# EAGLE design OpAmpLab (EAGLE 7.6.0)
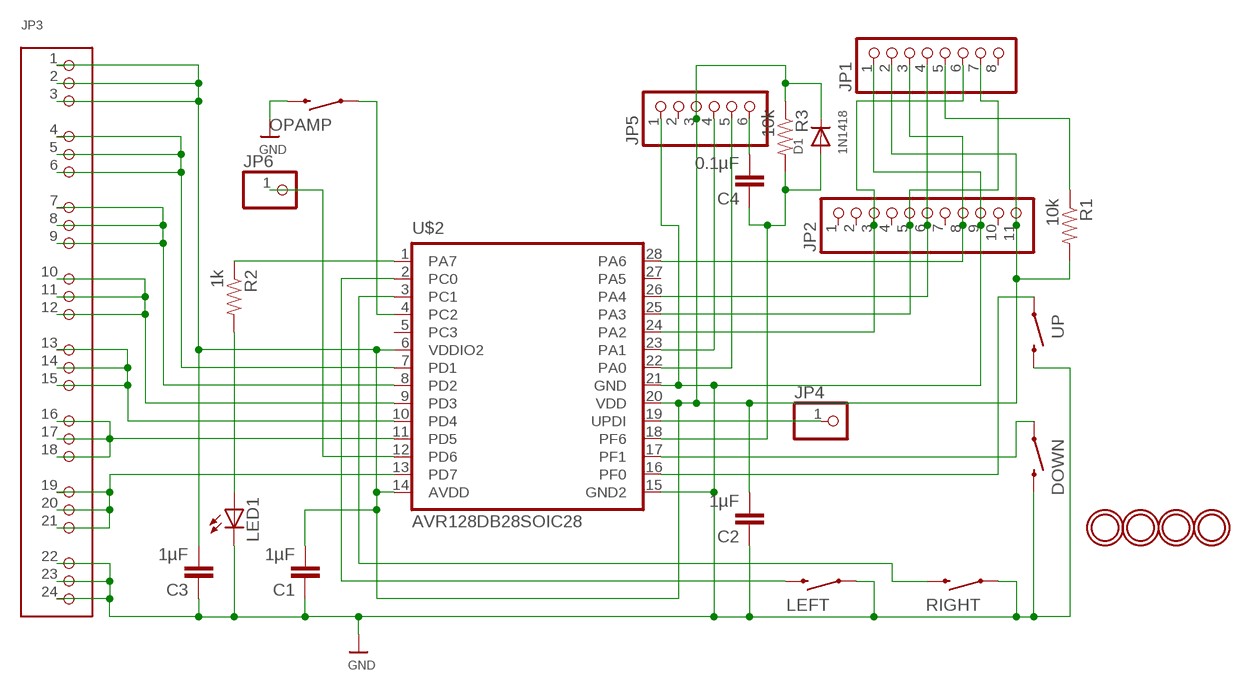
[diagram p0: schematic, sheet 1]

## Parts
C1  1µF  CAP0805  [0805]
C2  1µF  CAP0805  [0805]
C3  1µF  CAP0805  [0805]
C4  0.1µF  CAP0805  [0805]
D1  1N1418  DIODESOD-323F  [SOD-323F]
DOWN  SWITCH-MOMENTARY-2PTH  [TACTILE-PTH]
JP1  HEADER-1X8ROUND  [1X08_ROUND]
JP2  HEADER-1X11  [1X11_ROUND]
JP3  HEADER-3X08  [3X08]
JP4  HEADER-1X1ROUND  [1X01_ROUND]
JP5  HEADER-1X6ROUND  [1X06_ROUND]
JP6  HEADER-1X1ROUND  [1X01_ROUND]
LED1  LEDCHIPLED_0805  [CHIPLED_0805]
LEFT  SWITCH-MOMENTARY-2PTH  [TACTILE-PTH]
OPAMP  SWITCH-MOMENTARY-2PTH  [TACTILE-PTH]
R1  10k  0.3OHM-1/8W-1%(0805)  [0805]
R2  1k  0.3OHM-1/8W-1%(0805)  [0805]
R3  10k  0.3OHM-1/8W-1%(0805)  [0805]
RIGHT  SWITCH-MOMENTARY-2PTH  [TACTILE-PTH]
U$1  MOUNTINGHOLE2.5  [MOUNTINGHOLE_2.5_PLATED]
U$2  AVR128DB28SOIC28  [SO-28W]
U$4  MOUNTINGHOLE2.5  [MOUNTINGHOLE_2.5_PLATED]
U$5  MOUNTINGHOLE2.5  [MOUNTINGHOLE_2.5_PLATED]
U$9  MOUNTINGHOLE2.5  [MOUNTINGHOLE_2.5_PLATED]
UP  SWITCH-MOMENTARY-2PTH  [TACTILE-PTH]

## Nets
GND: C1.1 C2.1 C3.1 DOWN.3 JP1.1 JP2.9 JP3.22 JP3.23 JP3.24 JP5.1 LED1.C LEFT.1 OPAMP.3 RIGHT.1 U$2.15(GND2) U$2.21(GND) UP.3
N$1: JP4.1 U$2.19(UPDI)
N$2: JP1.7 JP2.5 U$2.25(PA3)
N$3: JP5.4 U$2.23(PA1)
N$4: JP1.5 R1.1
N$5: JP1.3 JP2.8 U$2.28(PA6)
N$6: JP6.1 U$2.12(PD6)
N$7: OPAMP.1 U$2.4(PC2)
N$8: U$2.16(PF0) UP.1
N$9: R2.1 U$2.1(PA7)
N$10: DOWN.1 U$2.17(PF1)
N$11: JP3.4 JP3.5 JP3.6 U$2.7(PD1)
N$12: LEFT.3 U$2.2(PC0)
N$13: RIGHT.3 U$2.3(PC1)
N$14: JP3.7 JP3.8 JP3.9 U$2.8(PD2)
N$15: JP1.4 JP2.6 U$2.26(PA4)
N$16: JP1.6 JP2.3 U$2.24(PA2)
N$17: JP5.5 U$2.22(PA0)
N$18: JP3.10 JP3.11 JP3.12 U$2.9(PD3)
N$19: JP3.19 JP3.20 JP3.21 U$2.13(PD7)
N$20: JP3.13 JP3.14 JP3.15 U$2.10(PD4)
N$21: LED1.A R2.2
N$22: JP3.16 JP3.17 JP3.18 U$2.11(PD5)
N$23: C4.2 JP5.6
N$24: C4.1 D1.A R3.2 U$2.18(PF6)
VDD: C1.2 C2.2 C3.2 D1.C JP1.2 JP2.11 JP3.1 JP3.2 JP3.3 JP5.3 R1.2 R3.1 U$2.6(VDDIO2) U$2.14(AVDD) U$2.20(VDD)
Unconnected: JP1.8 JP2.1 JP2.2 JP2.4 JP2.7 JP2.10 JP5.2 U$2.5(PC3) U$2.27(PA5)

## Library data of the parts
C1-C4 = SparkFun-Capacitors:CAP: Capacitor Standard 0603 ceramic capacitor, and 0.1" leaded capacitor.
D1 = adafruit:DIODE: Diode SMADIODE - SMA Surface Mount Package 20V 1A Schottky Diode Digikey: 641-1014-6-ND DO-1N4148 - Through Hole Small Current Diode SOD-123 20V 1 A (.5mV Vf) Schottky Diode - Digikey: MBRX120TPMSCT-ND SOD-323 10V 570mA (.38mV Vf, 3ns) Schottky Diode - Digikey: ZLLS410CT-ND SOD-523 30V 30mA Schottky Diode (RB751S-40TE61) - Digikey: RB751S-40TE61CT-ND SOT23-R/W - SOT23 Package (R = Solder Paste/Reflow Ovens, W = Hand-Soldering) BAT54Film 40V 300mA - Digikey: 497-7162-1-ND
DOWN LEFT OPAMP RIGHT UP = SparkFun-Electromechanical:SWITCH-MOMENTARY-2: Various NO switches- pushbuttons, reed, etc; PROD_ID: SWCH-08441
JP1 = technoblogy:HEADER-1X8: PIN HEADER
JP2 = technoblogy:HEADER-1X11
JP3 = microbuilder:HEADER-3X08: 3x8 0.1" Headers Male - 4UCON: 01058
JP4 JP6 = microbuilder:HEADER-1X1: PIN HEADER
JP5 = microbuilder:HEADER-1X6: PIN HEADER
LED1 = adafruit:LED: LED OSRAM: - CHIPLED LG R971, LG N971, LY N971, LG Q971, LY Q971, LO R971, LY R971 LH N974, LH R974 LS Q976, LO Q976, LY Q976 LO Q996 - Hyper CHIPLED LW Q18S LB Q993, LB Q99A, LB R99A - SideLED LS A670, LO A670, LY A670, LG A670, LP A670 LB A673, LV A673, LT A673, LW A673 LH A674 LY A675 LS A676, LA A676, LO A676, LY A676, LW A676 LS A679, LY A679, LG A679 - Hyper Micro SIDELED® LS Y876, LA Y876, LO Y876, LY Y876 LT Y87S - SmartLED LW L88C, LW L88S LB L89C, LB L89S, LG L890 LS L89K, LO L89K, LY L89K LS L896, LA L896, LO L896, LY L896 - TOPLED LS T670, LO T670, LY T670, LG T670, LP T670 LSG T670, LSP T670, LSY T670, LOP T670, LYG T670 LG T671, LOG T671, LSG T671 LB T673, LV T673, LT T673, LW T673 LH T674 LS T676, LA T676, LO T676, LY T676, LB T676, LH T676, LSB T676, LW T676 LB T67C, LV T67C, LT T67C, LS T67K, LO T67K, LY T67K, LW E67C LS E67B, LA E67B, LO E67B, LY E67B, LB E67C, LV E67C, LT E67C LW T67C LS T679, LY T679, LG T679 LS T770, LO T770, LY T770, LG T770, LP T770 LB T773, LV T773, LT T773, LW T773 LH T774 LS E675, LA E675, LY E675, LS T675 LS T776, LA T776, LO T776, LY T776, LB T776 LHGB T686 LT T68C, LB T68C - Hyper Mini TOPLED® LB M676 - Mini TOPLED Santana® LG M470 LS M47K, LO M47K, LY M47K Source: http://www.osram.convergy.de/
R1-R3 = SparkFun-Resistors:0.3OHM-1/8W-1%(0805): RES-11622; PROD_ID: RES-11622; VALUE: 0.3
U$1 U$4 U$5 U$9 = microbuilder:MOUNTINGHOLE: Mounting Hole For #2 screws (0.086"/2.18mm width, 0.094"/2.4mm hole) use 2.5mm; BOM: EXCLUDE
U$2 = technoblogy:AVR128DB28

## Board
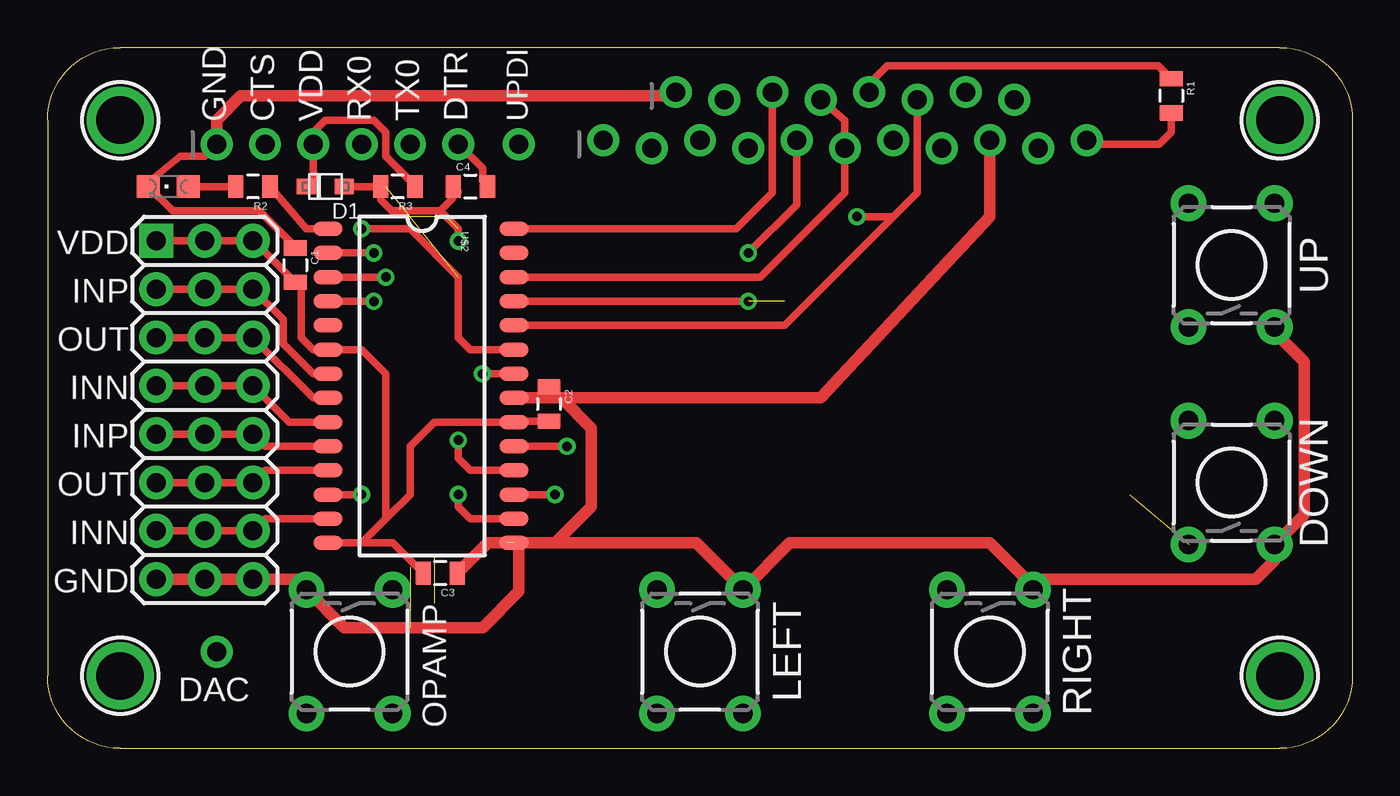
[diagram p1: board, top side]
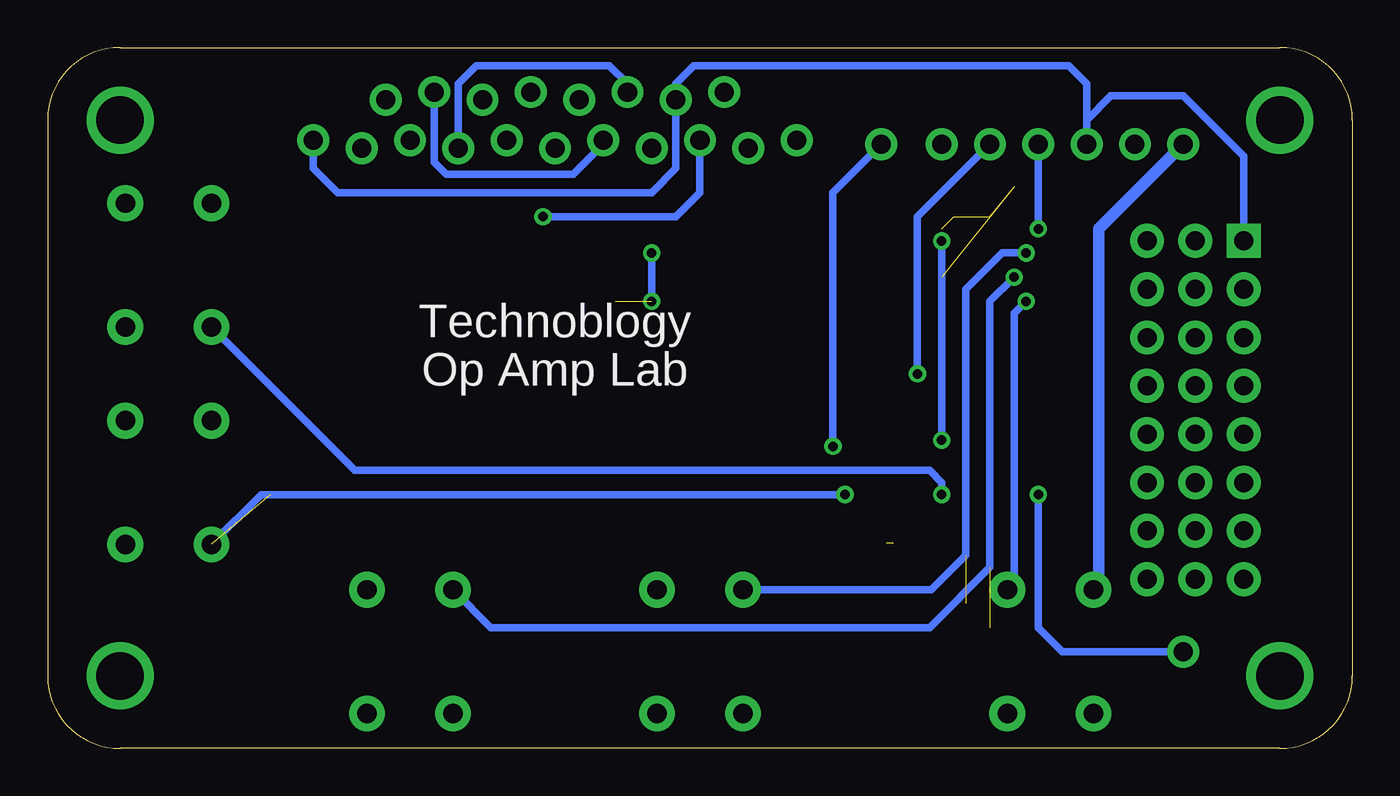
[diagram p2: board, bottom side, seen from below]

Size 68.58 x 36.83 mm. Coordinates in mm from the lower left corner, seen from the top.
Outline: 0,33.02 arc-90 3.81,36.83 64.77,36.83 arc-90 68.58,33.02 68.58,3.81 arc-90 64.77,0 3.81,0 arc-90 0,3.81 0,33.02
Copper layers (1*16): Top 0.035mm / dielectric 1.5mm / Bottom 0.035mm
Design rules "default *": minimum track width 10mil, minimum drill 24mil, track to track 8mil, track to pad 8mil, pad to pad 8mil, via to via 8mil, smd to smd 8mil, copper to edge 40mil, drill to drill 8mil, minimum pad ring 10mil, minimum via ring 8mil, stop-mask expansion 4mil, vias tented up to drill 20mil, thermal gap 10mil

### Footprints (pad centres in the part's own frame; a part is rotated, then mirrored left to right if it is on the bottom)
0805 = smd 0.8 x 1.2: 1 -0.9,0; 2 0.9,0
SOD-323F = smd 1 x 0.8: A -1,0; C 1,0
TACTILE-PTH = drill 1.016 pad 1.88: 1 -3.251,2.261; 2 3.251,2.261; 3 -3.251,-2.261; 4 3.251,-2.261
1X08_ROUND = drill 1 pad 1.676: 1 -8.89,0.203; 2 -6.35,-0.203; 3 -3.81,0.203; 4 -1.27,-0.203; 5 1.27,0.203; 6 3.81,-0.203; 7 6.35,0.203; 8 8.89,-0.203
1X11_ROUND = drill 1 pad 1.676: 1 -12.7,0.203; 2 -10.16,-0.203; 3 -7.62,0.203; 4 -5.08,-0.203; 5 -2.54,0.203; 6 0,-0.203; 7 2.54,0.203; 8 5.08,-0.203; 9 7.62,0.203; 10 10.16,-0.203; 11 12.7,0.203
3X08 = drill 1 pad 1.778 square: 1 -8.89,-2.54 | drill 1 pad 1.778: 2 -8.89,0; 3 -8.89,2.54; 4 -6.35,-2.54; 5 -6.35,0; 6 -6.35,2.54; 7 -3.81,-2.54; 8 -3.81,0; 9 -3.81,2.54; 10 -1.27,-2.54; 11 -1.27,0; 12 -1.27,2.54; 13 1.27,-2.54; 14 1.27,0; 15 1.27,2.54; 16 3.81,-2.54; 17 3.81,0; 18 3.81,2.54; 19 6.35,-2.54; 20 6.35,0; 21 6.35,2.54; 22 8.89,-2.54; 23 8.89,0; 24 8.89,2.54
1X01_ROUND = drill 1 pad 1.676: 1 0,0
1X06_ROUND = drill 1 pad 1.676: 1 -6.35,0; 2 -3.81,0; 3 -1.27,0; 4 1.27,0; 5 3.81,0; 6 6.35,0
CHIPLED_0805 = smd 1.2 x 1.2: A 0,-1.05; C 0,1.05
MOUNTINGHOLE_2.5_PLATED = drill 2.5 pad 3.2: P$1 0,0
SO-28W = smd 0.762 x 1.524: 1 -8.255,-4.953; 2 -6.985,-4.953; 3 -5.715,-4.953; 4 -4.445,-4.953; 5 -3.175,-4.953; 6 -1.905,-4.953; 7 -0.635,-4.953; 8 0.635,-4.953; 9 1.905,-4.953; 10 3.175,-4.953; 11 4.445,-4.953; 12 5.715,-4.953; 13 6.985,-4.953; 14 8.255,-4.953; 15 8.255,4.826; 16 6.985,4.826; 17 5.715,4.826; 18 4.445,4.826; 19 3.175,4.826; 20 1.905,4.826; 21 0.635,4.826; 22 -0.635,4.826; 23 -1.905,4.826; 24 -3.175,4.826; 25 -4.445,4.826; 26 -5.715,4.826; 27 -6.985,4.826; 28 -8.255,4.826

### Placement (x,y rotation side)
C1  13.02,25.4 270 top
C2  26.35,18.1 270 top
C3  20.64,9.21 180 top
C4  22.23,29.53 0 top
D1  14.61,29.53 180 top
DOWN  62.23,13.97 90 top
JP1  41.91,34.29 0 top
JP2  41.91,31.75 0 top
JP3  8.26,17.78 270 top
JP4  24.77,31.75 0 top
JP5  15.24,31.75 0 top
JP6  8.89,5.08 0 top
LED1  6.35,29.53 90 top
LEFT  34.29,5.08 270 top
OPAMP  15.88,5.08 270 top
R1  59.05,34.29 270 top
R2  10.79,29.53 180 top
R3  18.41,29.53 180 top
RIGHT  49.53,5.08 270 top
U$1  64.77,33.02 0 top
U$2  19.68,19.05 270 top
U$4  64.77,3.81 0 top
U$5  3.81,3.81 0 top
U$9  3.81,33.02 0 top
UP  62.23,25.4 90 top

### Tracks (layer width: path | path; a pad name or v marks a point on that pad's centre or on a via)
5V  (2 unrouted)
GND  (1 unrouted)
  Top 0.406: JP5.1 8.26,31.11 6.99,31.11 5.3,29.75 LED1.C 6.57,28.26 11.11,28.26 13.02,26.35 C1.1 | C2.1 26.67,18.41
  Top 0.61: U$2.21 26.67,18.41 26.99,18.41 | 26.99,18.41 40.64,18.41 49.53,27.94 JP2.9 | UP.3 64.49,21.87 66.04,20.32 66.04,12.27 DOWN.3 64.49,9.88 63.5,8.89 52.35,8.89 RIGHT.1 51.79,8.53 49.53,10.79 39.01,10.79 LEFT.1 34.09,10.79 26.67,10.79 | JP3.22 JP3.23 JP3.24 13.06,8.89 OPAMP.3 15.6,6.35 22.86,6.35 24.77,8.26 24.77,10.54 U$2.15 26.67,10.79 | 26.67,10.79 28.57,12.7 28.57,16.83 26.99,18.41 | JP1.1 33.02,34.29 10.16,34.29 8.89,33.02 JP5.1 | 24.13,10.79 23.12,10.79 C3.1
  Bottom 0.61: JP5.1 13.34,27.3 13.34,8.61 OPAMP.3
N$1  (via drill 0.5)
  Top 0.406: U$2.19 v27.3,15.88
  Bottom 0.406: v27.3,15.88 27.3,29.21 JP4.1
N$2  (via drill 0.5)  (1 unrouted)
  Top 0.406: U$2.25 v36.83,23.5 | JP2.5 39.37,28.57 v36.83,26.04
  Bottom 0.406: JP1.7 48.26,30.8 47.62,30.16 40.96,30.16 39.37,31.75 JP2.5 | v36.83,26.04 v36.83,23.5
N$3  (via drill 0.5)  (4 unrouted)
  Top 0.406: U$2.23 22.23,20.95 21.59,21.59 21.59,24.77 19.05,27.3 v16.51,27.3
  Bottom 0.406: JP5.4 v16.51,27.3
N$4
  Top 0.406: R1.1 58.37,35.88 44.13,35.88 43.18,34.92 JP1.5
N$5
  Top 0.406: U$2.28 36.2,27.3 38.1,29.21 JP1.3
  Bottom 0.406: JP1.3 38.1,34.92 39.05,35.88 46.04,35.88 46.99,34.92 JP2.8
N$6  (via drill 0.5)
  Top 0.406: U$2.12 v16.51,13.34
  Bottom 0.406: v16.51,13.34 16.51,6.35 15.24,5.08 JP6.1
N$7  (via drill 0.5)
  Top 0.406: U$2.4 v17.14,23.5
  Bottom 0.406: v17.14,23.5 17.78,22.86 17.78,8.69 OPAMP.1
N$8  (via drill 0.5)
  Top 0.406: U$2.16 22.23,12.06 21.59,12.7 v21.59,13.34
  Bottom 0.406: v21.59,13.34 21.59,13.97 22.23,14.61 52.43,14.61 UP.1
N$9
  Top 0.406: U$2.1 13.6,27.3 R2.1
N$10  (via drill 0.5)  (1 unrouted)
  Top 0.406: U$2.17 v26.67,13.34
  Bottom 0.406: v26.67,13.34 57.35,13.34 DOWN.1
N$11
  Top 0.406: JP3.4 JP3.5 JP3.6 12.38,22.54 12.38,21.27 13.97,19.68 U$2.7
N$12  (via drill 0.5)  (1 unrouted)
  Top 0.406: U$2.2 v17.14,26.04
  Bottom 0.406: v17.14,26.04 18.41,26.04 20.32,24.13 20.32,10.16 22.15,8.33 LEFT.3
N$13  (via drill 0.5)  (1 unrouted)
  Top 0.406: U$2.3 v17.78,24.77
  Bottom 0.406: v17.78,24.77 19.05,23.5 19.05,9.53 22.23,6.35 45.29,6.35 RIGHT.3
N$14
  Top 0.406: JP3.7 JP3.8 JP3.9 13.97,18.41 U$2.8
N$15
  Top 0.406: JP1.4 41.91,33.02 JP2.6 41.91,29.21 37.47,24.77 U$2.26
N$16  (via drill 0.5)
  Top 0.406: U$2.24 38.73,22.23 44.45,27.94 | JP1.6 45.72,29.21 44.45,27.94 | v42.55,27.94 44.45,27.94
  Bottom 0.406: JP2.3 34.29,29.21 35.56,27.94 v42.55,27.94
N$17  (via drill 0.5)
  Top 0.406: U$2.22 v22.86,19.68
  Bottom 0.406: v22.86,19.68 22.86,27.94 JP5.5
N$18
  Top 0.406: JP3.10 JP3.11 JP3.12 12.7,17.14 U$2.9
N$19
  Top 0.406: JP3.19 JP3.20 JP3.21 11.43,12.06 U$2.13
N$20
  Top 0.406: JP3.13 JP3.14 JP3.15 11.43,15.88 U$2.10
N$21
  Top 0.406: R2.2 LED1.A
N$22
  Top 0.406: JP3.16 JP3.17 JP3.18 11.43,14.61 U$2.11
N$23
  Top 0.406: JP5.6 22.86,30.48 22.86,29.79 C4.2
N$24  (via drill 0.5)
  Top 0.406: 21.59,29.26 C4.1 21.27,29.48 21.27,28.89 20.64,28.26 | 20.64,28.26 18.1,28.26 17.52,28.84 R3.2 D1.A | U$2.18 22.23,14.61 21.59,15.24 v21.59,16.19 | v21.59,26.67 21.59,27.3 20.64,28.26
  Bottom 0.406: v21.59,26.67 v21.59,16.19
VDD
  Top 0.406: 17.78,12.06 17.78,19.68 16.51,20.95 U$2.6 13.97,20.95 13.34,21.59 13.34,24.18 C1.2 10.85,26.67 JP3.3 JP3.2 JP3.1 | R1.2 59.05,32.38 58.42,31.75 54.61,31.75 JP2.11 | D1.C 13.97,29.89 JP5.3 13.97,32.38 14.61,33.02 17.14,33.02 17.78,32.38 17.78,31.11 19.32,29.58 R3.1 | 17.78,12.06 16.51,10.79 U$2.14 18.15,10.79 C3.2 | 17.78,12.06 19.05,13.34 19.05,15.88 20.32,17.14 U$2.20 24.51,17.2 C2.2
  Bottom 0.406: JP2.11 54.61,30.48 53.34,29.21 36.83,29.21 35.56,30.48 JP1.2 35.56,34.92 34.61,35.88 14.92,35.88 13.97,34.92 JP5.3 13.97,33.02 12.7,34.29 8.89,34.29 5.71,31.11 JP3.1

### Text on the board
tPlace: GND | CTS | VDD | RX0 | TX0 | DTR | UPDI | VDD | INP | OUT | INN | INP | OUT | INN | GND | DAC
bPlace: Technoblogy | Op Amp Lab